# Altium project SlotCarController.PrjPcb
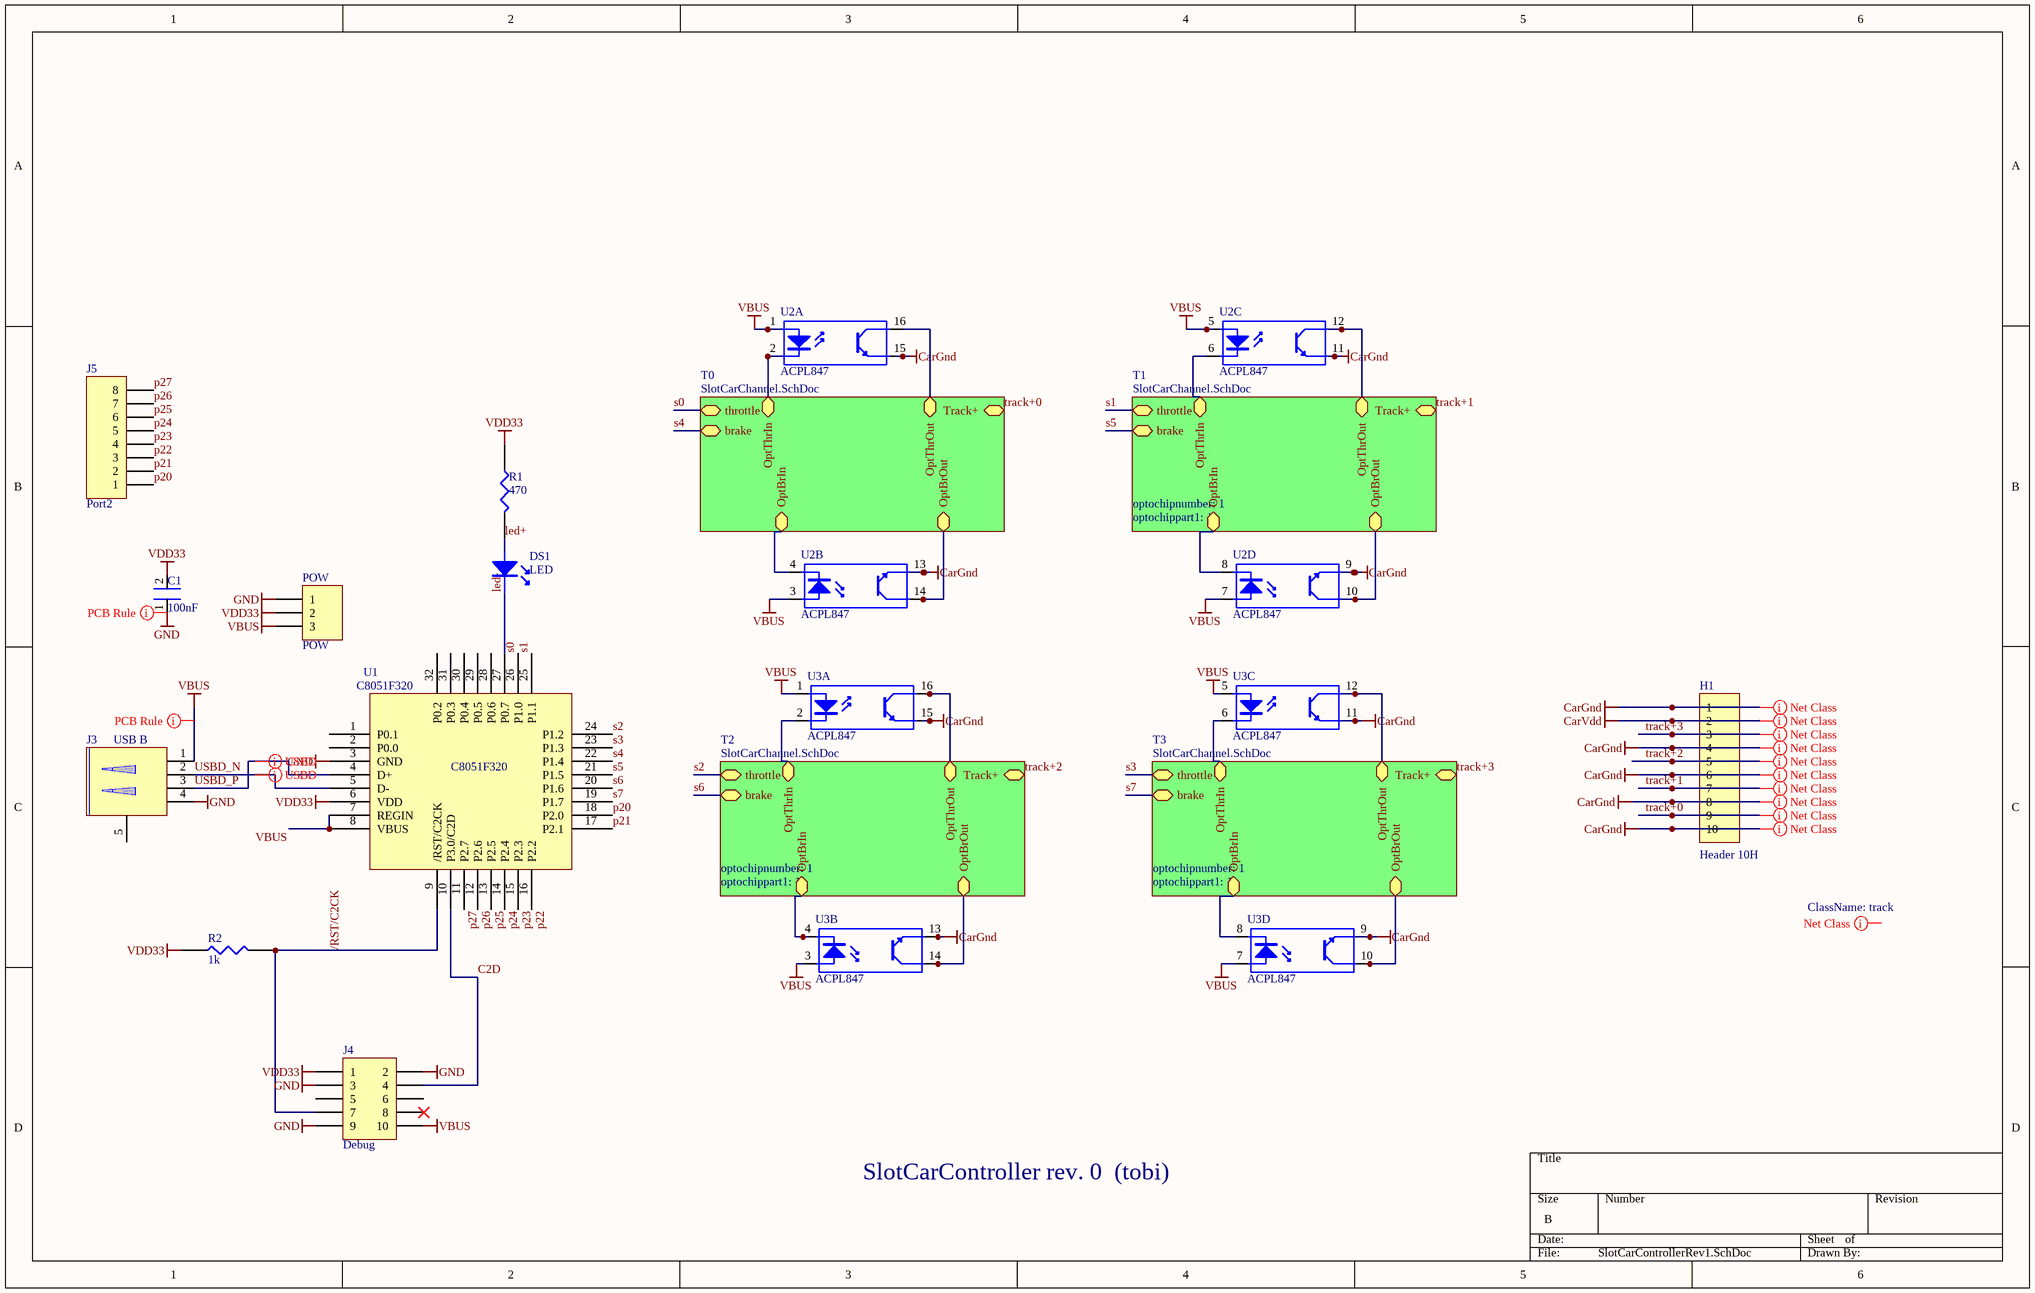
[diagram p0: SlotCarControllerRev1.SchDoc]
2 sheets, 56 parts. Net scope: hierarchical (ports join the sheet entries above them; power ports are global).
Board file: SlotCarControllerRev1.PcbDoc
Sheets:
  SlotCarControllerRev1.SchDoc
    T0 = SlotCarChannel.SchDoc
    T2 = SlotCarChannel.SchDoc
    T1 = SlotCarChannel.SchDoc
    T3 = SlotCarChannel.SchDoc

## Sheet SlotCarControllerRev1.SchDoc
size B; Author: T Delbruck; CompanyName: INI; DrawnBy: T Delbruck; Engineer: T Delbruck; Organization: INI; Address1: tobi@ini.phys.ethz.ch; DocumentName: SimpleMonitorUSBXPress

### Parts
C1  100nF  [CC1608-0603]
DS1  LED  [0805LED]
H1  Header 10H  [SL508/10/90]
J3  USB B  [usb]
J4  Debug  [HDR2X5]
J5  Port2  [HDR1X8]
POW  POW  [HDR1X3]
R1  470  [CR1608-0603]
R2  1k  [CR1608-0603]
U1  C8051F320  [TQFP32]
U2  ACPL847  [DIP16]  (parts A,B,C,D of 4)
U3  ACPL847  [DIP16]  (parts A,B,C,D of 4)

### Sub-sheets
T0 = SlotCarChannel.SchDoc: throttle, brake, Track+, OptThrIn, OptThrOut, OptBrIn, OptBrOut
T1 = SlotCarChannel.SchDoc: throttle, brake, Track+, OptThrIn, OptThrOut, OptBrIn, OptBrOut  | optochipnumber: 1; optochippart1: 1
T2 = SlotCarChannel.SchDoc: throttle, brake, Track+, OptThrIn, OptThrOut, OptBrIn, OptBrOut  | optochipnumber: 1; optochippart1: 1
T3 = SlotCarChannel.SchDoc: throttle, brake, Track+, OptThrIn, OptThrOut, OptBrIn, OptBrOut  | optochipnumber: 1; optochippart1: 1

### Nets
CarGnd: H1.1 H1.4 H1.6 H1.8 H1.10 U2.9 U2.11 U2.13 U2.15 U3.9 U3.11 U3.13 U3.15
CarVdd: H1.2
GND: C1.1 J3.4 J4.2 J4.3 J4.9 POW.1 U1.3(GND)
VBUS: J3.1 J4.10 POW.3 U1.7(REGIN) U1.8(VBUS) U2.1(A) U2.3 U2.5 U2.7 U3.1(A) U3.3 U3.5 U3.7
VDD33: C1.2 J4.1 POW.2 R1.1 R2.1 U1.6(VDD)
/RST/C2CK: J4.7 R2.2 U1.9(/RST/C2CK)
C2D: J4.4 U1.10(P3.0/C2D)
led+: DS1.+ R1.2
led-: DS1.- U1.27(P0.7)
p20: J5.1 U1.18(P2.0)
p21: J5.2 U1.17(P2.1)
p22: J5.3 U1.16(P2.2)
p23: J5.4 U1.15(P2.3)
p24: J5.5 U1.14(P2.4)
p25: J5.6 U1.13(P2.5)
p26: J5.7 U1.12(P2.6)
p27: J5.8 U1.11(P2.7)
s0: U1.26(P1.0) ; sheet T0/throttle
s1: U1.25(P1.1) ; sheet T1/throttle
s2: U1.24(P1.2) ; sheet T2/throttle
s3: U1.23(P1.3) ; sheet T3/throttle
s4: U1.22(P1.4) ; sheet T0/brake
s5: U1.21(P1.5) ; sheet T1/brake
s6: U1.20(P1.6) ; sheet T2/brake
s7: U1.19(P1.7) ; sheet T3/brake
track+0: H1.9 ; sheet T0/Track+
track+1: H1.7 ; sheet T1/Track+
track+2: H1.5 ; sheet T2/Track+
track+3: H1.3 ; sheet T3/Track+
USBD_N: J3.2 U1.5(D-)
USBD_P: J3.3 U1.4(D+)
NetMN_T0_1: U2.14 ; sheet T0/OptBrOut
NetMN_T1_1: U2.10 ; sheet T1/OptBrOut
NetMN_T2_1: U3.14 ; sheet T2/OptBrOut
NetMN_T3_1: U3.10 ; sheet T3/OptBrOut
NetR3_T0_2: U2.16 ; sheet T0/OptThrOut
NetR3_T1_2: U2.12 ; sheet T1/OptThrOut
NetR3_T2_2: U3.16 ; sheet T2/OptThrOut
NetR3_T3_2: U3.12 ; sheet T3/OptThrOut
NetR4_T0_2: U2.4 ; sheet T0/OptBrIn
NetR4_T1_2: U2.8 ; sheet T1/OptBrIn
NetR4_T2_2: U3.4 ; sheet T2/OptBrIn
NetR4_T3_2: U3.8 ; sheet T3/OptBrIn
NetR15_T0_2: U2.2(K) ; sheet T0/OptThrIn
NetR15_T1_2: U2.6 ; sheet T1/OptThrIn
NetR15_T2_2: U3.2(K) ; sheet T2/OptThrIn
NetR15_T3_2: U3.6 ; sheet T3/OptThrIn

Not connected (* = marked no-connect by the designer): J3 5; J4 5 6 8*; U1 1(P0.1) 2(P0.0) 28(P0.6) 29(P0.5) 30(P0.4) 31(P0.3) 32(P0.2)

### Layout directives
rule Width Constraint [Pref Width = 20mil    Min Width = 10mil    Max Width = 60mil]: GND, VBUS
net class track; rule Undefined: (no net found under the mark), CarGnd, CarVdd, track+0, track+1, track+2, track+3
net class track: CarGnd
differential pair; rule Differential Pairs Routing [Pref Gap = 10mil    Min Gap  = 10mil    Max Gap  = 10mil]: USBD_P
differential pair; rule Undefined: USBD_N

### Notes on the sheet
- SlotCarController rev. 0  (tobi)

### Library data of the parts
C1 = CAPCHIP
DS1 = LED: LED, SMT 3mm by 1.5mm
H1 = Header 10H: Header, 10-Pin, Right Angle; LatestRevisionDate: 17-Jul-2002; LatestRevisionNote: Re-released for DXP Platform.; Publisher: Altium Limited
J3 = USB: USB TypB
J4 = Header 5X2: Header, 5-Pin, Dual row; Revision: 17-Jul-2002: Re-released for DXP Platform.; Publisher: Altium Limited
J5 = Header 8: Header, 8-Pin; Revision: 17-Jul-2002: Re-released for DXP Platform.; Publisher: Altium Limited
POW = Header 3: Header, 3-Pin; Revision: 17-Jul-2002: Re-released for DXP Platform.; Publisher: Altium Limited
R1 R2 = RES1
U1 = C8051F320: Silicon Labs USB Microcontroller
U2 U3 = Opto16: 16-Pin 4-channel Phototransistor Optocoupler; Published: 24-Mar-1999; LatestRevisionDate: 04-Mar-2005; LatestRevisionNote: Sch pins 3 & 4 Swapped.; DatasheetDocument: Nov-2003; PackageReference: DIP-16; Publisher: tobi

## Sheet SlotCarChannel.SchDoc
size A
Used 4 times, as channels T0, T2, T1, T3. Parts and nets are listed once, with the designators drawn on the sheet.
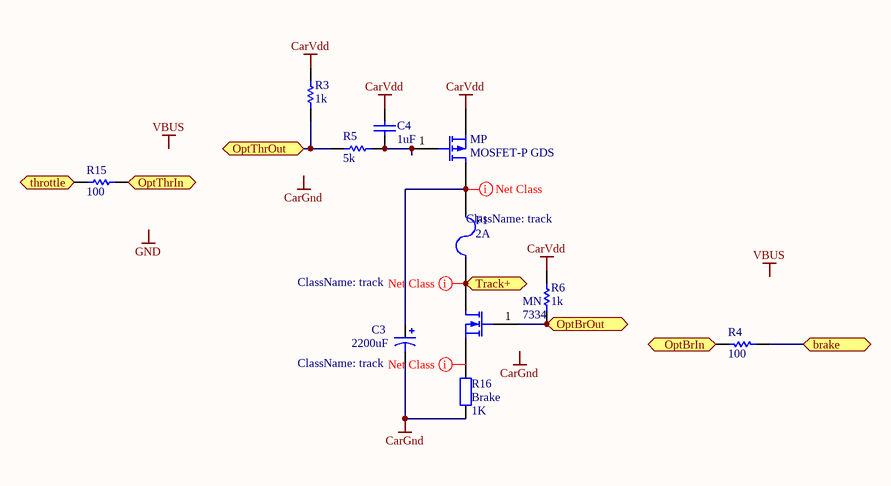
[diagram p1: SlotCarChannel.SchDoc]

### Parts
C3  2200uF  [CAPPR5-12.5x35]
C4  1uF  [CC1608-0603]
F1  2A  [2920Littelfuse]
MN  7334  [TO220_HEATSINK]
MP  MOSFET-P GDS  [TO220_HEATSINK]
R3  1k  [CR1608-0603]
R4  100  [CR1608-0603]
R5  5k  [CR1608-0603]
R6  1k  [CR1608-0603]
R15  100  [CR1608-0603]
R16  Brake  value 1K  [Axial 0.4]

### Ports
brake, OptBrIn, OptBrOut, OptThrIn, OptThrOut, throttle, Track+

### Nets
CarGnd: C3.2 R16.1
CarVdd: C4.2 MP.3(S) R3.1 R6.1
brake: R4.1 ; port brake
OptBrIn: R4.2 ; port OptBrIn
OptBrOut: MN.1(G) R6.2 ; port OptBrOut
OptThrIn: R15.2 ; port OptThrIn
OptThrOut: R3.2 R5.2 ; port OptThrOut
throttle: R15.1 ; port throttle
Track+: F1.1 MN.2(D) ; port Track+
NetC3_1: C3.1 F1.2 MP.2(D)
NetC4_1: C4.1 MP.1(G) R5.1
NetMN_3: MN.3(S) R16.2

### Channels
T0: designators end in _T0; ports brake=s4 OptBrIn=NetR4_T0_2 OptBrOut=NetMN_T0_1 OptThrIn=NetR15_T0_2 OptThrOut=NetR3_T0_2 throttle=s0 Track+=track+0
T2: designators end in _T2; ports brake=s6 OptBrIn=NetR4_T2_2 OptBrOut=NetMN_T2_1 OptThrIn=NetR15_T2_2 OptThrOut=NetR3_T2_2 throttle=s2 Track+=track+2
T1: designators end in _T1; ports brake=s5 OptBrIn=NetR4_T1_2 OptBrOut=NetMN_T1_1 OptThrIn=NetR15_T1_2 OptThrOut=NetR3_T1_2 throttle=s1 Track+=track+1
T3: designators end in _T3; ports brake=s7 OptBrIn=NetR4_T3_2 OptBrOut=NetMN_T3_1 OptThrIn=NetR15_T3_2 OptThrOut=NetR3_T3_2 throttle=s3 Track+=track+3

### Layout directives
net class track; rule Undefined: NetC3_T0_1, NetMN_T0_3, track+0

### Notes on the sheet
- Labels drawn without touching a wire or pin: CarGnd, GND, VBUS

### Library data of the parts
C3 = Cap Pol1: Polarized Capacitor (Radial); Value: 100pF; Published: 8-Jun-2000; LatestRevisionDate: 17-Jul-2002; LatestRevisionNote: Re-released for DXP Platform.; PackageReference: RB7.6-15; Publisher: Altium Limited
C4 = Cap Semi: Capacitor (Semiconductor SIM Model); Value: 100pF; Published: 8-Jun-2000; LatestRevisionDate: 17-Jul-2002; LatestRevisionNote: Re-released for DXP Platform.; PackageReference: C1206; Publisher: Altium Limited
F1 = Fuse 2: Fuse; Published: 8-Jun-2000; LatestRevisionDate: 17-Jul-2002; LatestRevisionNote: Re-released for DXP Platform.; PackageReference: PIN-W2/E2.8; Publisher: Altium Limited
MN = MOSFET-N-GDS: N-Channel MOSFET; PackageDocument: 1995/1996; Published: 8-Jun-2000; LatestRevisionDate: 17-Jul-2002; LatestRevisionNote: Re-released for DXP Platform.; PackageReference: E3; Publisher: Altium Limited
MP = MOSFET-P-GDS: P-Channel MOSFET; PackageDocument: 1995/1996; Published: 8-Jun-2000; LatestRevisionDate: 17-Jul-2002; LatestRevisionNote: Re-released for DXP Platform.; PackageReference: E3; Publisher: Altium Limited
R3 R6 = Res Semi: Semiconductor Resistor; Published: 8-Jun-2000; LatestRevisionDate: 17-Jul-2002; LatestRevisionNote: Re-released for DXP Platform.; PackageReference: AXIAL-0.5; Publisher: Altium Limited; Value: 1K
R4 R5 R15 = Res Semi: Semiconductor Resistor; Value: 1K; Published: 8-Jun-2000; LatestRevisionDate: 17-Jul-2002; LatestRevisionNote: Re-released for DXP Platform.; PackageReference: AXIAL-0.5; Publisher: Altium Limited
R16 = Res2: Resistor; Published: 8-Jun-2000; LatestRevisionDate: 17-Jul-2002; LatestRevisionNote: Re-released for DXP Platform.; PackageReference: AXIAL-0.4; Publisher: Altium Limited

## Nets that join several sheets
CarGnd: SlotCarControllerRev1 (13 pins), T0 (C3_T0.2 R16_T0.1), T2 (C3_T2.2 R16_T2.1), T1 (C3_T1.2 R16_T1.1), T3 (C3_T3.2 R16_T3.1)
CarVdd: SlotCarControllerRev1 (H1.2), T0 (C4_T0.2 MP_T0.3 R3_T0.1 R6_T0.1), T2 (C4_T2.2 MP_T2.3 R3_T2.1 R6_T2.1), T1 (C4_T1.2 MP_T1.3 R3_T1.1 R6_T1.1), T3 (C4_T3.2 MP_T3.3 R3_T3.1 R6_T3.1)
NetMN_T0_1: SlotCarControllerRev1 (U2.14), T0 (MN_T0.1 R6_T0.2)
NetMN_T1_1: SlotCarControllerRev1 (U2.10), T1 (MN_T1.1 R6_T1.2)
NetMN_T2_1: SlotCarControllerRev1 (U3.14), T2 (MN_T2.1 R6_T2.2)
NetMN_T3_1: SlotCarControllerRev1 (U3.10), T3 (MN_T3.1 R6_T3.2)
NetR3_T0_2: SlotCarControllerRev1 (U2.16), T0 (R3_T0.2 R5_T0.2)
NetR3_T1_2: SlotCarControllerRev1 (U2.12), T1 (R3_T1.2 R5_T1.2)
NetR3_T2_2: SlotCarControllerRev1 (U3.16), T2 (R3_T2.2 R5_T2.2)
NetR3_T3_2: SlotCarControllerRev1 (U3.12), T3 (R3_T3.2 R5_T3.2)
NetR4_T0_2: SlotCarControllerRev1 (U2.4), T0 (R4_T0.2)
NetR4_T1_2: SlotCarControllerRev1 (U2.8), T1 (R4_T1.2)
NetR4_T2_2: SlotCarControllerRev1 (U3.4), T2 (R4_T2.2)
NetR4_T3_2: SlotCarControllerRev1 (U3.8), T3 (R4_T3.2)
NetR15_T0_2: SlotCarControllerRev1 (U2.2), T0 (R15_T0.2)
NetR15_T1_2: SlotCarControllerRev1 (U2.6), T1 (R15_T1.2)
NetR15_T2_2: SlotCarControllerRev1 (U3.2), T2 (R15_T2.2)
NetR15_T3_2: SlotCarControllerRev1 (U3.6), T3 (R15_T3.2)
s0: SlotCarControllerRev1 (U1.26), T0 (R15_T0.1)
s1: SlotCarControllerRev1 (U1.25), T1 (R15_T1.1)
s2: SlotCarControllerRev1 (U1.24), T2 (R15_T2.1)
s3: SlotCarControllerRev1 (U1.23), T3 (R15_T3.1)
s4: SlotCarControllerRev1 (U1.22), T0 (R4_T0.1)
s5: SlotCarControllerRev1 (U1.21), T1 (R4_T1.1)
s6: SlotCarControllerRev1 (U1.20), T2 (R4_T2.1)
s7: SlotCarControllerRev1 (U1.19), T3 (R4_T3.1)
track+0: SlotCarControllerRev1 (H1.9), T0 (F1_T0.1 MN_T0.2)
track+1: SlotCarControllerRev1 (H1.7), T1 (F1_T1.1 MN_T1.2)
track+2: SlotCarControllerRev1 (H1.5), T2 (F1_T2.1 MN_T2.2)
track+3: SlotCarControllerRev1 (H1.3), T3 (F1_T3.1 MN_T3.2)